# EAGLE design audio (EAGLE 7.2.0)
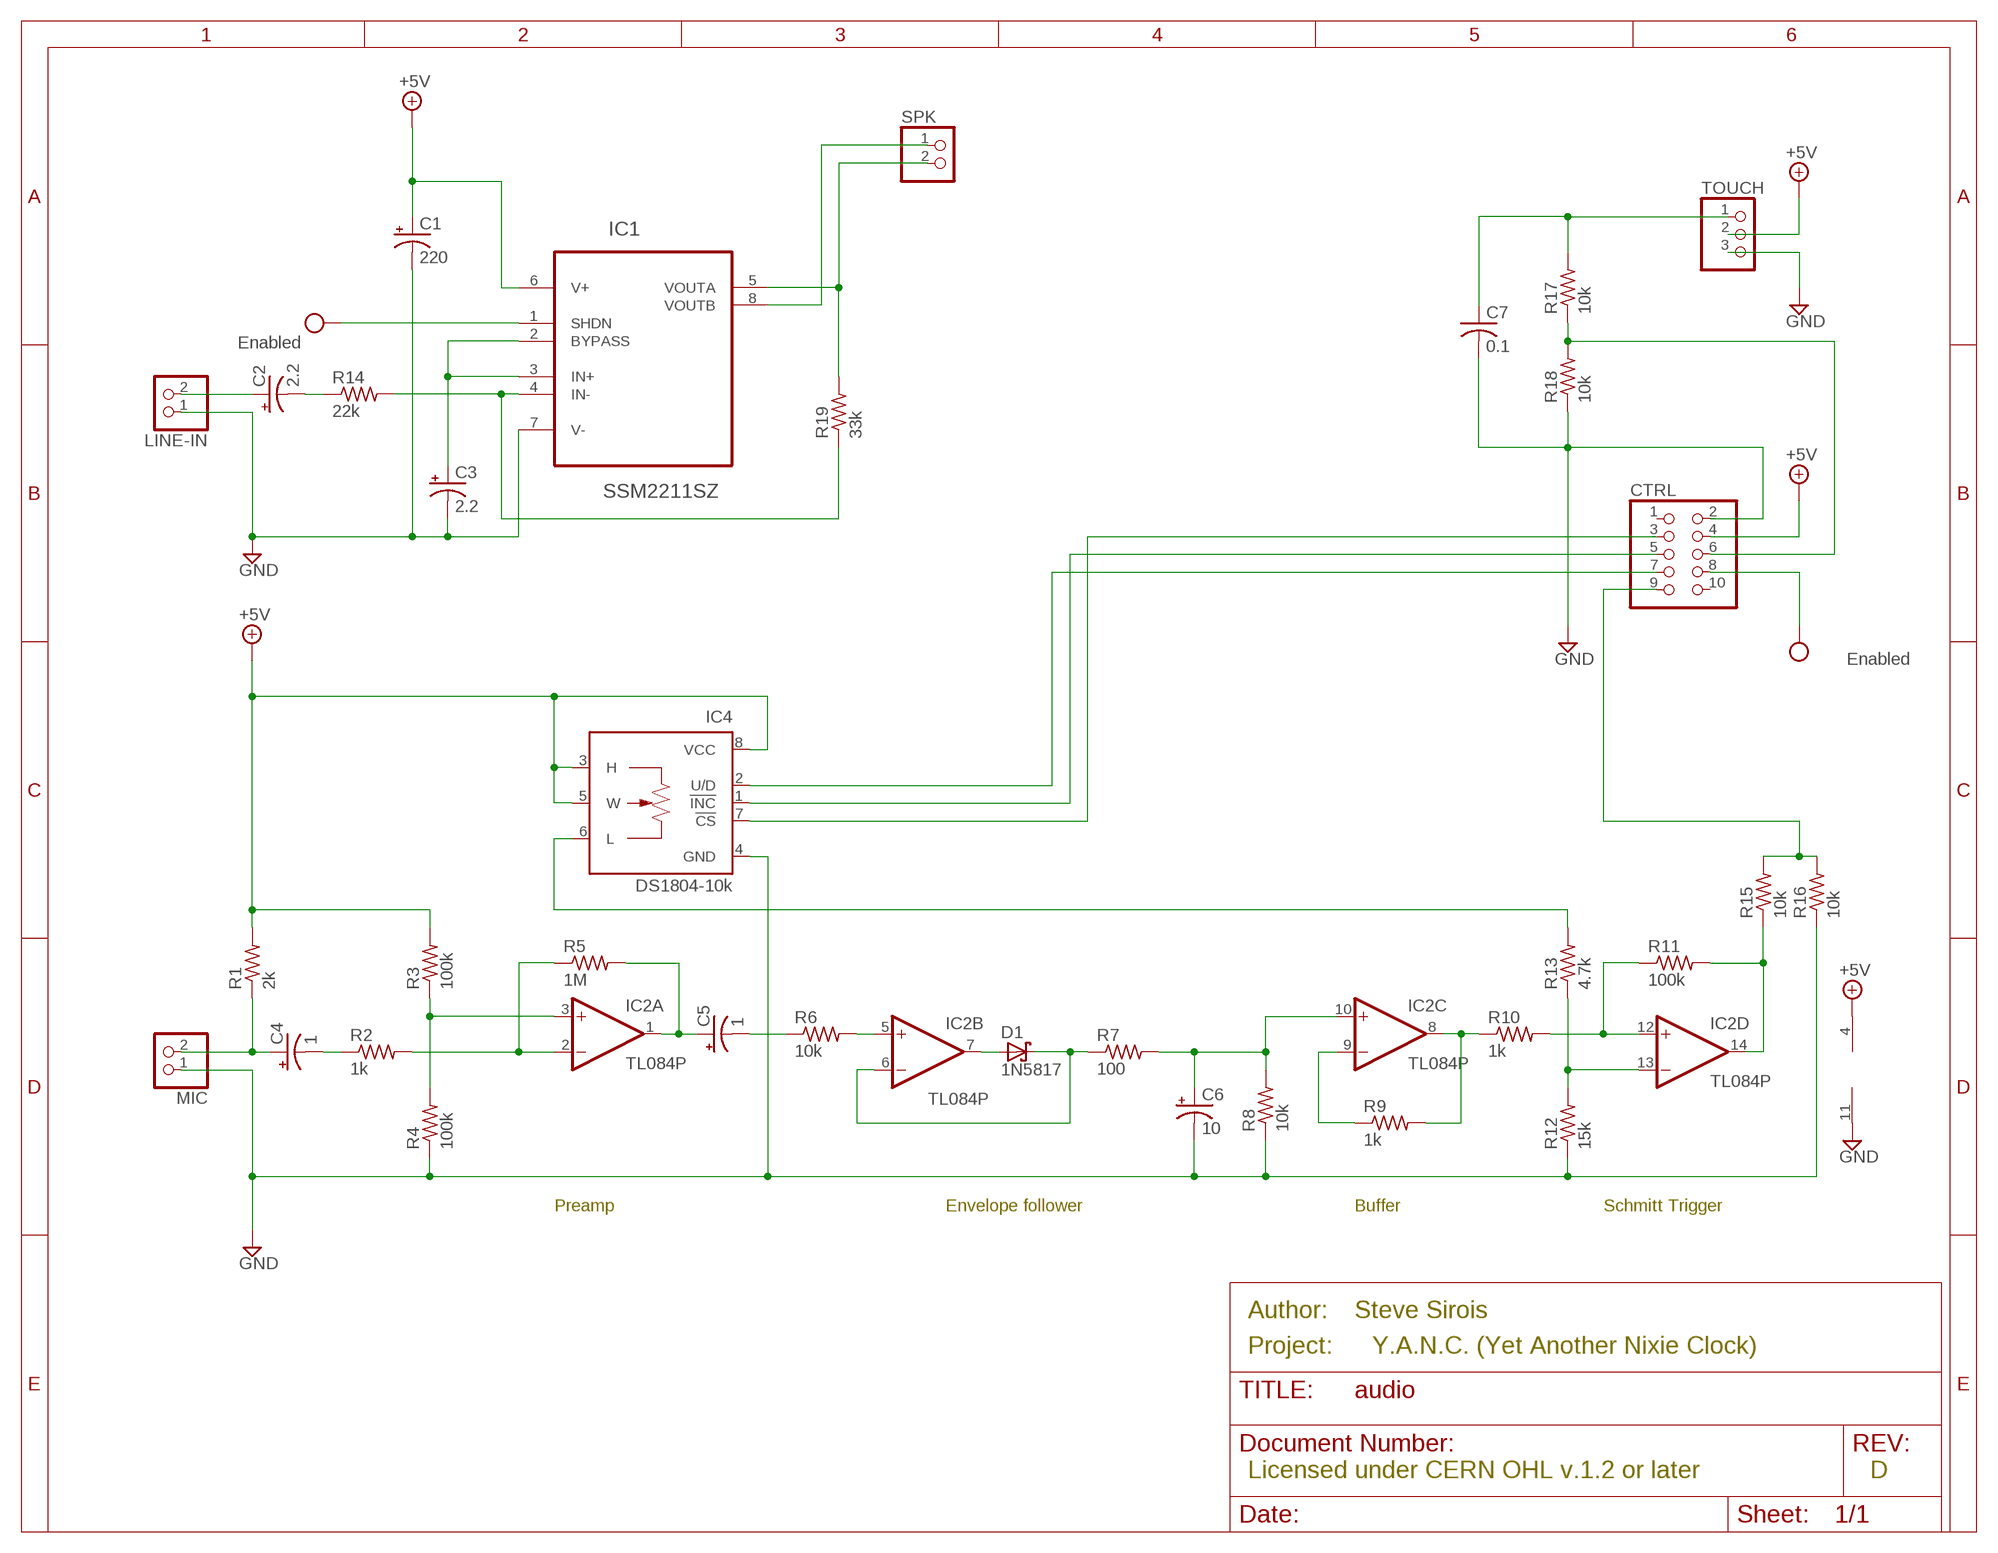
[diagram p0: schematic, sheet 1]

## Parts
C1  220  CPOL-USE3.5-10  [E3,5-10]
C2  2.2  CPOL-USE3.5-8  [E3,5-8]
C3  2.2  CPOL-USE3.5-8  [E3,5-8]
C4  1  CPOL-USE2-4  [E2-4]
C5  1  CPOL-USE2-4  [E2-4]
C6  10  CPOL-USE2-4  [E2-4]
C7  0.1  C-US025-024X044  [C025-024X044]
CTRL  PINHD-2X5  [2X05]
D1  1N5817  SCHOTTKY-DIODEDO41-7  [DO41-7]
IC1  SSM2211SZ  [SOIC127P600X175-8N]
IC2  TL084P  [DIL14]
IC4  DS1804-10k  X9C102P  [DIL08]
LINE-IN  PINHD-1X2  [1X02]
MIC  PINHD-1X2  [1X02]
R1  2k  R-US_0204/2V  [0204V]
R2  1k  R-US_0204/2V  [0204V]
R3  100k  R-US_0204/2V  [0204V]
R4  100k  R-US_0204/2V  [0204V]
R5  1M  R-US_0204/2V  [0204V]
R6  10k  R-US_0204/2V  [0204V]
R7  100  R-US_0204/2V  [0204V]
R8  10k  R-US_0204/2V  [0204V]
R9  1k  R-US_0204/2V  [0204V]
R10  1k  R-US_0204/2V  [0204V]
R11  100k  R-US_0204/2V  [0204V]
R12  15k  R-US_0204/2V  [0204V]
R13  4.7k  R-US_0204/2V  [0204V]
R14  22k  R-US_0204/2V  [0204V]
R15  10k  R-US_0204/2V  [0204V]
R16  10k  R-US_0204/2V  [0204V]
R17  10k  R-US_0204/2V  [0204V]
R18  10k  R-US_0204/2V  [0204V]
R19  33k  R-US_0204/2V  [0204V]
SPK  PINHD-1X2  [1X02]
TOUCH  PINHD-1X3  [1X03]

## Nets
+5V: C1.+ CTRL.4 IC1.6(V+) IC2.4(P:V+) IC4.3(H) IC4.5(W) IC4.8(VCC) R1.2 R3.2 TOUCH.2
GND: C1.- C3.- C6.- C7.2 CTRL.2 IC1.7(V-) IC2.11(P:V-) IC4.4(GND) LINE-IN.1 MIC.1 R4.1 R8.1 R12.1 R16.1 R18.1 TOUCH.3
N$1: IC1.5(VOUTA) R19.2 SPK.2
N$2: C2.+ LINE-IN.2
N$3: C2.- R14.1
N$4: IC1.4(IN-) R14.2 R19.1
N$5: C3.+ IC1.2(BYPASS) IC1.3(IN+)
N$6: IC1.8(VOUTB) SPK.1
N$7: IC4.6(L) R13.2
N$8: C4.- R2.1
N$9: C4.+ MIC.2 R1.1
N$10: IC2.2(A:-IN) R2.2 R5.1
N$11: C5.+ IC2.1(A:OUT) R5.2
N$12: C5.- R6.1
N$14: IC2.14(D:OUT) R11.2 R15.1
N$15: IC2.3(A:+IN) R3.1 R4.2
N$16: CTRL.9 R15.2 R16.2
N$17: D1.A IC2.7(B:OUT)
N$18: IC2.5(B:+IN) R6.2
N$19: CTRL.3 IC4.7(!CS)
N$20: CTRL.5 IC4.1(!INC)
N$21: CTRL.7 IC4.2(U/D)
N$23: D1.C IC2.6(B:-IN) R7.1
N$24: C6.+ IC2.10(C:+IN) R7.2 R8.2
N$25: IC2.9(C:-IN) R9.1
N$26: IC2.8(C:OUT) R9.2 R10.1
N$27: IC2.12(D:+IN) R10.2 R11.1
N$28: C7.1 R17.2 TOUCH.1
N$29: IC2.13(D:-IN) R12.2 R13.1
N$30: CTRL.6 R17.1 R18.2
VCC: CTRL.8 IC1.1(SHDN) ; supply symbol labelled Enabled
Unconnected: CTRL.1 CTRL.10

## Notes on the sheet
- Preamp | Envelope follower | Buffer | Schmitt Trigger
- Author: | Steve Sirois
- Project: | Y.A.N.C. (Yet Another Nixie Clock)
- Licensed under CERN OHL v.1.2 or later | D

## Library data of the parts
C1-C6 = rcl:CPOL-US: POLARIZED CAPACITOR, American symbol
C7 = rcl:C-US: CAPACITOR, American symbol
CTRL = pinhead:PINHD-2X5: PIN HEADER
D1 = adafruit:SCHOTTKY-DIODE: Schottky Diode
IC1 = Analog Devices_By_element14_Batch_1:SSM2211SZ: Low Distortion, 1.5 W Audio Power Amplifier; MPN: SSM2211SZ; OC_FARNELL: 9994440; OC_NEWARK: 19M1049; PACKAGE: SOIC-8; SUPPLIER: Analog Devices
IC2 = linear:TL084: OP AMP
IC4 = pot-xicor:X9C102*: Digital POTENTIOMETER; MF: INTERSIL; MPN: X9C102P; OC_FARNELL: 1216104; OC_NEWARK: 51J6928
LINE-IN MIC SPK = pinhead:PINHD-1X2: PIN HEADER
R1-R19 = rcl:R-US_: RESISTOR, American symbol
TOUCH = adafruit:PINHD-1X3: PIN HEADER

## Net classes
0 default: clearance 0.205 mm

## Board
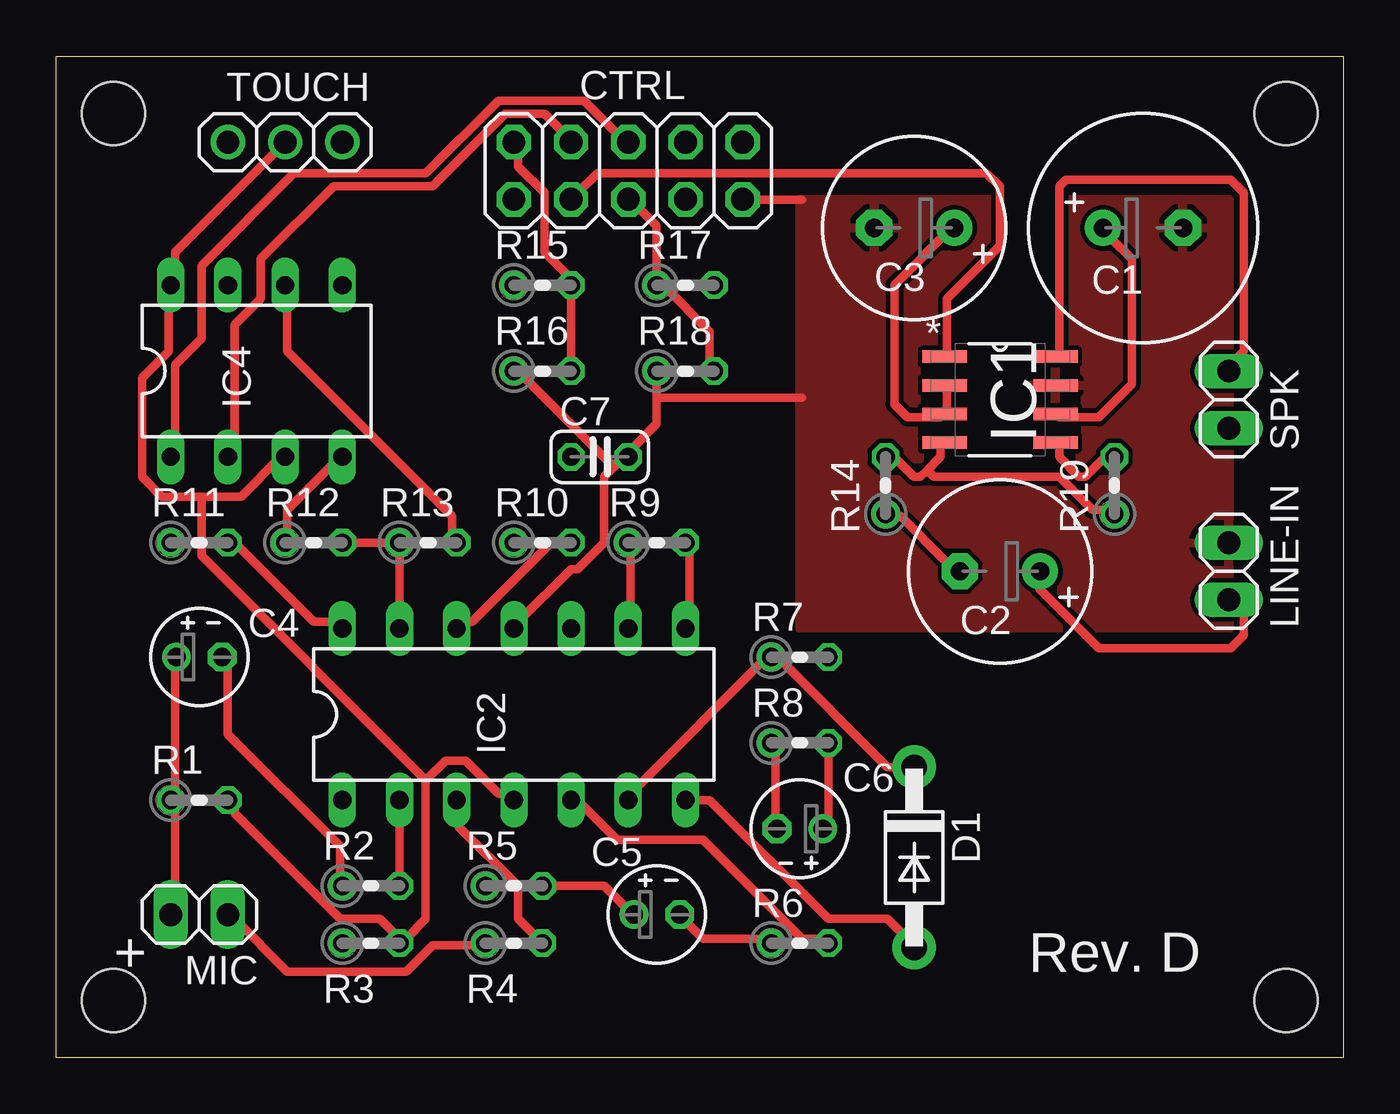
[diagram p1: board, top side]
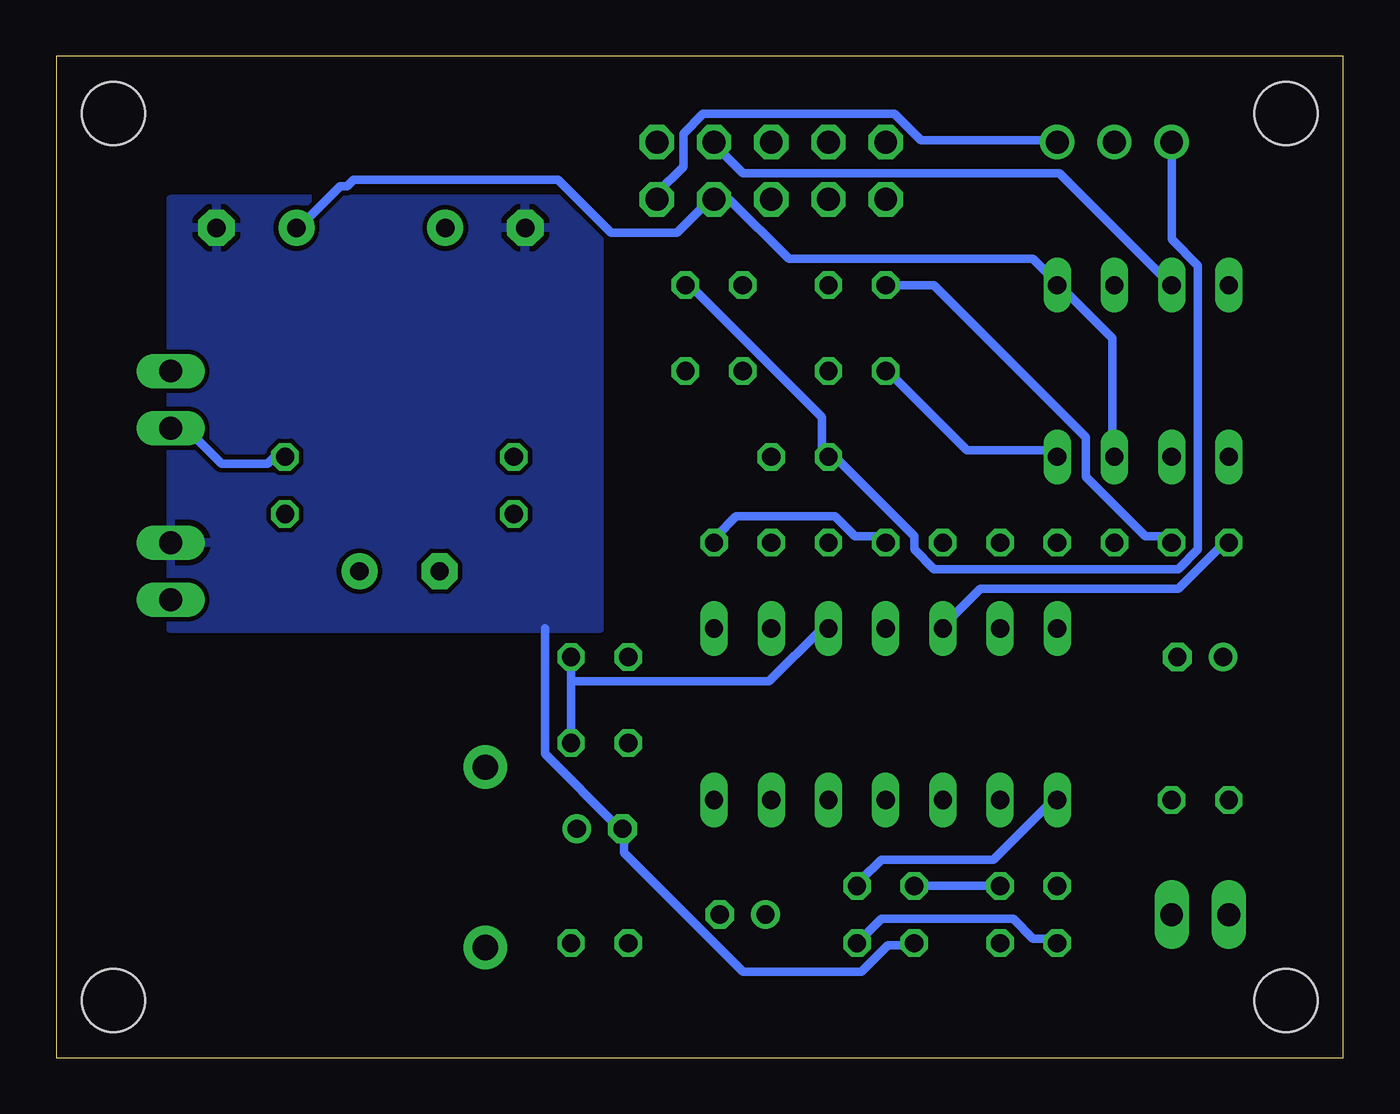
[diagram p2: board, bottom side, seen from below]

Size 57.15 x 44.45 mm. Coordinates in mm from the lower left corner, seen from the top.
Outline: 0,0 0,44.45 57.15,44.45 57.15,0 0,0
Copper layers (1*16): Top 0.0356mm / dielectric 1.5011mm / Bottom 0.0356mm
Design rules "osh *": minimum track width 15mil, minimum drill 13mil, track to track 6mil, track to pad 6mil, pad to pad 6mil, via to via 6mil, smd to smd 6mil, copper to edge 15mil, drill to drill 6mil, minimum pad ring 7mil, minimum via ring 7mil, stop-mask expansion 3mil, vias tented up to drill 0mil, thermal gap 10mil
Holes 2.8 mm at 2.54,2.54 2.54,41.91 54.61,41.91 54.61,2.54
tRestrict: area 40.6,26.7 to 43.2,31.8

### Footprints (pad centres in the part's own frame; a part is rotated, then mirrored left to right if it is on the bottom)
E3,5-10 = drill 0.813 pad 1.6: + -1.778,0 | drill 0.813 pad 1.6 octagon: - 1.778,0
E3,5-8 = drill 0.813 pad 1.6: + -1.778,0 | drill 0.813 pad 1.6 octagon: - 1.778,0
E2-4 = drill 0.813 pad 1.27: + -1.016,0 | drill 0.813 pad 1.27 octagon: - 1.016,0
C025-024X044 = drill 0.813 octagon: 1 -1.27,0; 2 1.27,0
2X05 = drill 1.016 octagon: 1 -5.08,-1.27; 2 -5.08,1.27; 3 -2.54,-1.27; 4 -2.54,1.27; 5 0,-1.27; 6 0,1.27; 7 2.54,-1.27; 8 2.54,1.27; 9 5.08,-1.27; 10 5.08,1.27
DO41-7 = drill 1.118 pad 1.93: A 4,0; C -4,0
SOIC127P600X175-8N = smd 1.981 x 0.559: 1 -2.464,1.905; 2 -2.464,0.635; 3 -2.464,-0.635; 4 -2.464,-1.905; 5 2.464,-1.905; 6 2.464,-0.635; 7 2.464,0.635; 8 2.464,1.905
DIL14 = drill 0.813 long: 1 -7.62,-3.81; 2 -5.08,-3.81; 3 -2.54,-3.81; 4 0,-3.81; 5 2.54,-3.81; 6 5.08,-3.81; 7 7.62,-3.81; 8 7.62,3.81; 9 5.08,3.81; 10 2.54,3.81; 11 0,3.81; 12 -2.54,3.81; 13 -5.08,3.81; 14 -7.62,3.81
DIL08 = drill 0.813 long: 1 -3.81,-3.81; 2 -1.27,-3.81; 3 1.27,-3.81; 4 3.81,-3.81; 5 3.81,3.81; 6 1.27,3.81; 7 -1.27,3.81; 8 -3.81,3.81
1X02 = drill 1.016 long: 1 -1.27,0; 2 1.27,0
0204V = drill 0.813 octagon: 1 -1.27,0; 2 1.27,0
1X03 = drill 1.016: 1 -2.54,0; 2 0,0; 3 2.54,0

### Placement (x,y rotation side)
C1  48.26,36.83 0 top
C2  41.91,21.59 180 top
C3  38.1,36.83 180 top
C4  6.35,17.78 0 top
C5  26.67,6.35 0 top
C6  33.02,10.16 180 top
C7  24.13,26.67 0 top
CTRL  25.4,39.37 180 top
D1  38.1,8.89 270 top
IC1  41.91,29.21 0 top
IC2  20.32,15.24 0 top
IC4  8.89,30.48 0 top
LINE-IN  52.07,21.59 270 top
MIC  6.35,6.35 180 top
R1  6.35,11.43 0 top
R2  13.97,7.62 0 top
R3  13.97,5.08 0 top
R4  20.32,5.08 0 top
R5  20.32,7.62 0 top
R6  33.02,5.08 0 top
R7  33.02,17.78 0 top
R8  33.02,13.97 0 top
R9  26.67,22.86 0 top
R10  21.59,22.86 0 top
R11  6.35,22.86 0 top
R12  11.43,22.86 0 top
R13  16.51,22.86 0 top
R14  36.83,25.4 90 top
R15  21.59,34.29 0 top
R16  21.59,30.48 0 top
R17  27.94,34.29 0 top
R18  27.94,30.48 0 top
R19  46.99,25.4 90 top
SPK  52.07,29.21 270 top
TOUCH  10.16,40.64 0 top

### Tracks (layer width: path | path; a pad name or v marks a point on that pad's centre or on a via)
+5V
  Top 0.381: R1.2 7.91,11.43 7.91,10.84 12.6,6.15 14.36,6.15 15.24,5.27 R3.2 15.53,5.27 16.41,6.15 16.41,12.31 | 16.41,12.31 17.29,13.19 18.17,13.19 19.63,11.72 20.22,11.72 IC2.4 | TOUCH.2 9.96,40.43 5.27,35.75 5.27,34.57 IC4.8 4.98,34.28 4.98,31.35 3.81,30.18 3.81,25.78 4.69,24.91 6.45,24.91 | IC1.6 44.54,28.42 46.29,28.42 47.76,29.89 47.76,35.45 46.88,36.33 46.59,36.33 46.29,36.62 C1.+ | 6.45,24.91 8.2,24.91 9.96,26.66 IC4.3 | 16.41,12.31 6.45,22.27 6.45,24.91
  Bottom 0.381: IC4.3 10.26,26.96 10.26,31.94 12.6,34.28 IC4.5 12.89,34.57 13.77,35.45 24.61,35.45 27.25,38.09 27.84,38.09 CTRL.4 28.13,38.09 29.59,36.62 32.52,36.62 34.87,38.97 43.95,38.97 44.24,38.68 44.54,38.68 46.29,36.92 C1.+
GND
  Top 0.381: R12.1 10.26,23.15 10.26,24.32 12.6,26.66 IC4.4 | 24.91,26.37 25.2,26.66 C7.2 | 24.91,26.37 24.32,25.78 24.32,22.85 23.15,21.68 22.85,21.68 20.51,19.34 IC2.11 | 24.91,26.37 24.61,26.37 20.51,30.47 R16.1 | 24.91,26.37 C7.2 | 26.66,29.3 26.66,28.13 25.49,26.96 C7.2 | 26.66,29.3 R18.1 | R4.1 19.05,4.98 16.7,4.98 15.53,3.81 10.26,3.81 7.91,6.15 MIC.1 | R8.1 31.94,13.77 31.94,10.26 C6.- | 33.11,38.09 30.77,38.09 CTRL.2 | 33.11,29.3 26.66,29.3
  Bottom 0.381: IC4.4 12.89,26.96 16.7,26.96 20.22,30.47 R16.1 | TOUCH.3 12.89,40.73 18.75,40.73 19.92,41.9 28.42,41.9 29.3,41.02 29.3,39.55 30.47,38.38 CTRL.2 | 35.45,19.05 35.45,13.48 32.23,10.26 C6.- 31.94,9.96 31.94,9.08 26.66,3.81 21.39,3.81 20.22,4.98 19.34,4.98 R4.1
  pour Bottom: 33.02,38.1 52.07,38.1 52.07,19.05 33.02,19.05
  pour Top: 33.02,38.1 52.07,38.1 52.07,19.05 33.02,19.05
N$1
  Top 0.381: IC1.5 44.54,27.25 44.54,26.66 45.41,25.78 45.71,25.78 46.88,26.96 R19.2
  Bottom 0.381: SPK.2 51.86,27.84 51.27,27.84 49.81,26.37 47.76,26.37 47.17,26.96 R19.2
N$2
  Top 0.381: LINE-IN.2 52.15,20.22 52.74,19.63 52.74,18.75 52.15,18.17 46.29,18.17 43.66,20.8 43.66,21.39 C2.+
N$3
  Top 0.381: R14.1 36.92,24.03 37.5,24.03 39.55,21.98 39.85,21.98 40.14,21.68 C2.-
N$4
  Top 0.381: 38.68,26.08 38.38,25.78 38.09,25.78 36.92,26.96 R14.2 | 38.68,26.08 39.26,26.66 39.26,27.25 IC1.4 | 38.68,26.08 38.97,25.78 44.54,25.78 46,24.32 46.88,24.32 R19.1
N$5
  Top 0.381: IC1.2 39.55,29.59 39.55,28.71 IC1.3 39.26,28.42 37.8,28.42 37.21,29.01 37.21,34.28 39.85,36.92 C3.+
N$6
  Top 0.381: IC1.8 44.54,31.35 44.54,38.68 44.83,38.97 52.15,38.97 52.74,38.38 52.74,31.35 52.15,30.77 SPK.1
N$7
  Top 0.381: IC4.6 10.26,34.28 10.26,31.35 17.58,24.03 17.58,23.15 R13.2
N$8
  Top 0.381: R2.1 12.6,7.91 12.6,9.38 7.62,14.36 7.62,17.58 C4.-
N$9
  Top 0.381: MIC.2 5.27,6.45 5.27,11.43 R1.1 5.27,11.72 5.27,17.58 C4.+
N$10
  Top 0.381: IC2.2 15.24,7.91 R2.2
  Bottom 0.381: R2.2 15.53,7.62 R5.1
N$11
  Top 0.381: R5.2 21.68,7.62 24.32,7.62 25.49,6.45 C5.+
  Bottom 0.381: IC2.1 12.89,11.43 15.53,8.79 20.51,8.79 21.39,7.91 R5.2
N$12
  Top 0.381: R6.1 31.64,5.27 28.71,5.27 27.84,6.15 C5.-
N$14
  Top 0.381: IC2.14 12.6,19.34 11.43,19.34 7.91,22.85 R11.2
  Bottom 0.381: R15.1 20.22,34.28 18.17,34.28 11.43,27.54 11.43,25.78 8.79,23.15 7.91,23.15 R11.2
N$15
  Top 0.381: IC2.3 17.87,11.43 17.87,10.26 20.51,7.62 20.51,6.15 21.39,5.27 R4.2
  Bottom 0.381: R3.1 12.89,5.27 13.77,5.27 14.65,6.15 20.51,6.15 21.39,5.27 R4.2
N$16
  Top 0.381: R16.2 22.85,30.77 R15.2 22.85,34.57 21.68,35.75 21.68,38.38 20.51,39.55 20.51,40.43 CTRL.9
N$17
  Top 0.381: IC2.7 28.13,11.43 29.01,11.43 34.28,6.15 36.92,6.15 38.09,4.98 D1.A
N$18
  Top 0.381: R6.2 34.28,5.27 33.11,5.27 28.71,9.67 24.91,9.67 23.15,11.43 IC2.5
N$19
  Bottom 0.381: IC4.7 7.91,34.57 12.6,39.26 26.66,39.26 27.84,40.43 CTRL.3
N$20
  Top 0.381: IC4.1 5.27,26.96 5.27,30.77 6.45,31.94 6.45,35.16 10.55,39.26 16.41,39.26 19.63,42.48 23.44,42.48 25.2,40.73 CTRL.5
N$21
  Top 0.381: IC4.2 7.91,26.96 7.91,32.52 9.08,33.7 9.08,35.45 12.31,38.68 16.7,38.68 19.92,41.9 21.68,41.9 22.85,40.73 CTRL.7
N$23
  Top 0.381: IC2.6 25.49,11.72 31.64,17.87 R7.1 31.94,17.87 36.92,12.89 D1.C
N$24
  Top 0.381: C6.+ 34.28,10.26 34.28,13.77 R8.2
  Bottom 0.381: 34.28,16.7 34.28,17.58 R7.2 | 34.28,16.7 34.28,14.06 R8.2 | 34.28,16.7 25.49,16.7 23.15,19.05 IC2.10
N$25
  Top 0.381: IC2.9 25.49,19.34 25.49,22.85 R9.1
N$26
  Top 0.381: IC2.8 28.13,19.34 28.13,22.85 R9.2
  Bottom 0.381: R10.1 20.51,23.15 21.68,23.15 22.56,24.03 26.96,24.03 27.84,23.15 R9.2
N$27
  Top 0.381: IC2.12 17.87,19.34 18.46,19.34 21.98,22.85 R10.2
  Bottom 0.381: R11.1 5.27,22.85 7.33,20.8 16.11,20.8 17.58,19.34 IC2.12
N$28
  Bottom 0.381: R17.2 29.01,34.28 23.15,28.42 23.15,26.96 C7.1 22.85,26.96 19.05,23.15 19.05,22.56 18.17,21.68 7.33,21.68 6.45,22.56 6.45,35.16 7.62,36.33 7.62,40.43 TOUCH.1
N$29
  Top 0.381: R13.1 12.89,22.85 R12.2 | R13.1 15.24,19.34 IC2.13 | R13.1
N$30
  Top 0.381: CTRL.6 25.49,38.09 26.66,36.92 26.66,34.57 R17.1 26.96,34.28 29.01,32.23 29.01,30.77 R18.2
VCC
  Top 0.381: IC1.1 39.55,31.35 39.55,33.7 41.9,36.04 41.9,38.68 41.31,39.26 24.03,39.26 23.15,38.38 CTRL.8

### Text on the board
tNames: + | Rev. D